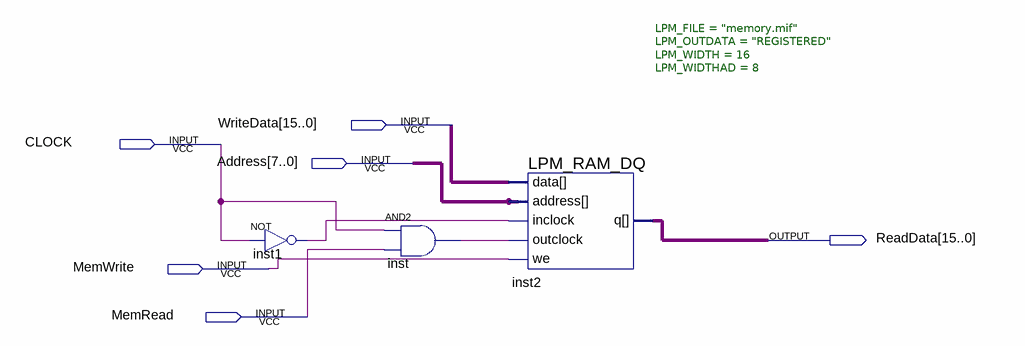
[diagram p0: schematic sheet]
// Quartus schematic Memory.bdf as structural Verilog: 3 symbols, 6 pins
module Memory (
  input  [15:0] WriteData,
  input  CLOCK,
  input  [7:0] Address,
  input  MemWrite,
  input  MemRead,
  output [15:0] ReadData
);

  wire inst1_out, inst_out;

  not inst1 (inst1_out, CLOCK);
  and inst (inst_out, CLOCK, MemRead);
  LPM_RAM_DQ #(.LPM_FILE("memory.mif"), .LPM_OUTDATA("REGISTERED"), .LPM_WIDTH(16), .LPM_WIDTHAD(8)) inst2 (
    .inclock(inst1_out), .data(WriteData), .address(Address), .we(MemWrite), .outclock(inst_out), .q(ReadData));
endmodule
